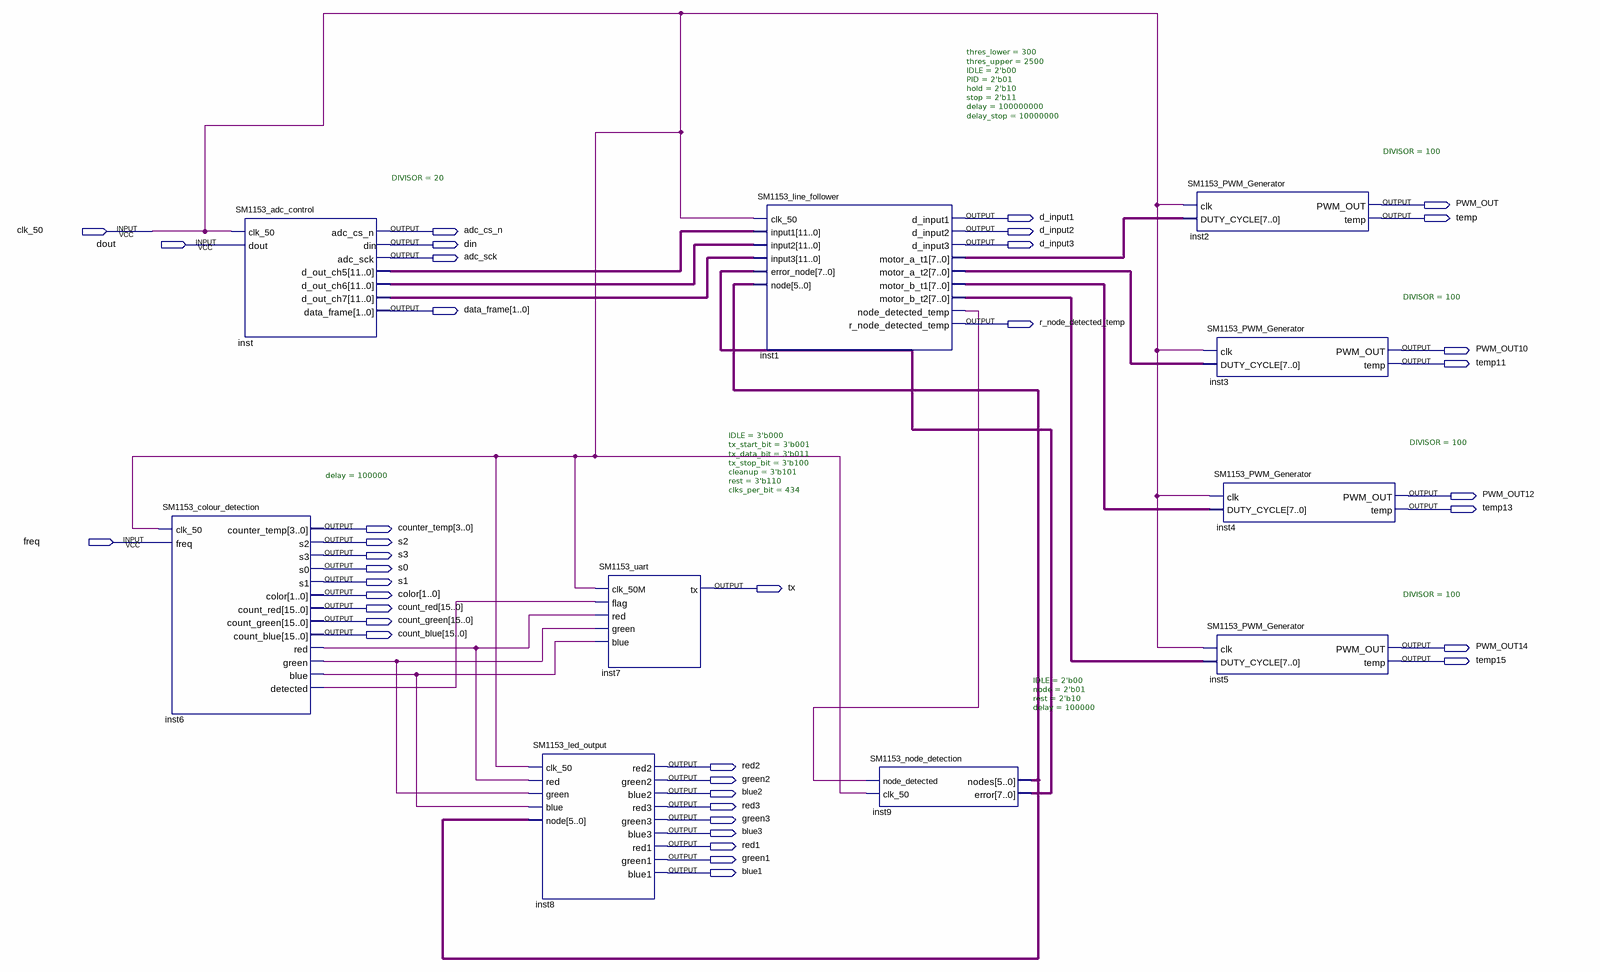
[diagram p0: schematic sheet]
// Quartus schematic task4.bdf as structural Verilog: 10 symbols, 38 pins
module task4 (
  input  clk_50,
  input  dout,
  input  freq,
  output PWM_OUT,
  output d_input1,
  output temp,
  output adc_cs_n,
  output d_input2,
  output din,
  output d_input3,
  output adc_sck,
  output [1:0] data_frame,
  output r_node_detected_temp,
  output PWM_OUT10,
  output temp11,
  output PWM_OUT12,
  output temp13,
  output [3:0] counter_temp,
  output s2,
  output s3,
  output s0,
  output s1,
  output tx,
  output [1:0] color,
  output [15:0] count_red,
  output [15:0] count_green,
  output [15:0] count_blue,
  output PWM_OUT14,
  output temp15,
  output red2,
  output green2,
  output blue2,
  output red3,
  output green3,
  output blue3,
  output red1,
  output green1,
  output blue1
);

  wire inst1_node_detected_temp, inst6_blue, inst6_detected, inst6_green, inst6_red;
  wire [5:0] inst9_nodes;
  wire [7:0] inst1_motor_a_t1, inst1_motor_a_t2, inst1_motor_b_t1, inst1_motor_b_t2, inst9_error;
  wire [11:0] inst_d_out_ch5, inst_d_out_ch6, inst_d_out_ch7;

  SM1153_colour_detection #(.delay(100000)) inst6 (
    .clk_50(clk_50), .freq(freq), .counter_temp(counter_temp), .s2(s2), .s3(s3), .s0(s0), .s1(s1),
    .color(color), .count_red(count_red), .count_green(count_green), .count_blue(count_blue),
    .red(inst6_red), .green(inst6_green), .blue(inst6_blue), .detected(inst6_detected));
  SM1153_adc_control #(.DIVISOR(20)) inst (
    .clk_50(clk_50), .dout(dout), .adc_cs_n(adc_cs_n), .din(din), .adc_sck(adc_sck),
    .d_out_ch5(inst_d_out_ch5), .d_out_ch6(inst_d_out_ch6), .d_out_ch7(inst_d_out_ch7),
    .data_frame(data_frame));
  SM1153_led_output inst8 (
    .clk_50(clk_50), .red(inst6_red), .green(inst6_green), .blue(inst6_blue), .node(inst9_nodes),
    .red2(red2), .green2(green2), .blue2(blue2), .red3(red3), .green3(green3), .blue3(blue3), .red1(red1),
    .green1(green1), .blue1(blue1));
  SM1153_uart #(.IDLE(3'b000), .tx_start_bit(3'b001), .tx_data_bit(3'b011), .tx_stop_bit(3'b100), .cleanup(3'b101), .rest(3'b110), .clks_per_bit(434)) inst7 (
    .clk_50M(clk_50), .flag(inst6_detected), .red(inst6_red), .green(inst6_green), .blue(inst6_blue), .tx(tx));
  SM1153_line_follower #(.thres_lower(300), .thres_upper(2500), .IDLE(2'b00), .PID(2'b01), .hold(2'b10), .stop(2'b11), .delay(100000000), .delay_stop(10000000)) inst1 (
    .clk_50(clk_50), .input1(inst_d_out_ch5), .input2(inst_d_out_ch6), .input3(inst_d_out_ch7),
    .error_node(inst9_error), .node(inst9_nodes), .d_input1(d_input1), .d_input2(d_input2),
    .d_input3(d_input3), .motor_a_t1(inst1_motor_a_t1), .motor_a_t2(inst1_motor_a_t2),
    .motor_b_t1(inst1_motor_b_t1), .motor_b_t2(inst1_motor_b_t2),
    .node_detected_temp(inst1_node_detected_temp), .r_node_detected_temp(r_node_detected_temp));
  SM1153_node_detection #(.IDLE(2'b00), .node(2'b01), .rest(2'b10), .delay(100000)) inst9 (
    .node_detected(inst1_node_detected_temp), .clk_50(clk_50), .nodes(inst9_nodes), .error(inst9_error));
  SM1153_PWM_Generator #(.DIVISOR(100)) inst2 (
    .clk(clk_50), .DUTY_CYCLE(inst1_motor_a_t1), .PWM_OUT(PWM_OUT), .temp(temp));
  SM1153_PWM_Generator #(.DIVISOR(100)) inst3 (
    .clk(clk_50), .DUTY_CYCLE(inst1_motor_a_t2), .PWM_OUT(PWM_OUT10), .temp(temp11));
  SM1153_PWM_Generator #(.DIVISOR(100)) inst4 (
    .clk(clk_50), .DUTY_CYCLE(inst1_motor_b_t1), .PWM_OUT(PWM_OUT12), .temp(temp13));
  SM1153_PWM_Generator #(.DIVISOR(100)) inst5 (
    .clk(clk_50), .DUTY_CYCLE(inst1_motor_b_t2), .PWM_OUT(PWM_OUT14), .temp(temp15));
endmodule
